# Altium schematic sheet XL1509-5.0_C29023681_XL1509-5.0_C2902368.schdoc
size 124 x 99 mm
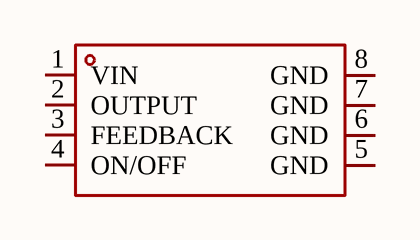
[diagram p0: XL1509-5.0_C29023681_XL1509-5.0_C2902368.schdoc]

## Parts
U?  XL1509-5.0  [SOIC-8_L4.9-W3.9-P1.27-LS6.0-TR]  (value not drawn)

## Nets

Not connected (* = marked no-connect by the designer): U? 1(VIN) 2(OUTPUT) 3(FEEDBACK) 4(ON/OFF) 5(GND) 6(GND) 7(GND) 8(GND)

## Library data of the parts
U? = XL1509-5.0: Manufacturer: UMW(友台半导体); Symbol: XL1509-5.0_C2902368; Add into BOM: yes; Function: 降压型; Output Type: 固定; Input Voltage: 4.5V~40V; Output Voltage: 5V; Output Current: 2A; Switching Frequency: 150kHz; Synchronous Rectification: 否; Number of Outputs: 1; Topology: 降压式; Quiescent Current (Iq): 150uA; Switch tube (built-in/external): 内置; Device: XL1509-5.0; LCSC Part Name: 150 KHz 固定频率 PWM 降压 DC/DC 转换器; Supplier Part: C2902368; Manufacturer Part: XL1509-5.0; Supplier Footprint: SOIC-8; JLCPCB Part Class: Extended Part; Datasheet: https://atta.szlcsc.com/upload/public/pdf/source/20241113/D9907419AB21EE12D855D7DFAFDDCB19.pdf; Supplier: LCSC; Convert to PCB: yes; Operating Temperature: -40℃~+125℃